# EAGLE design BusPirate-v3.5e-SSOP (EAGLE 5.11)
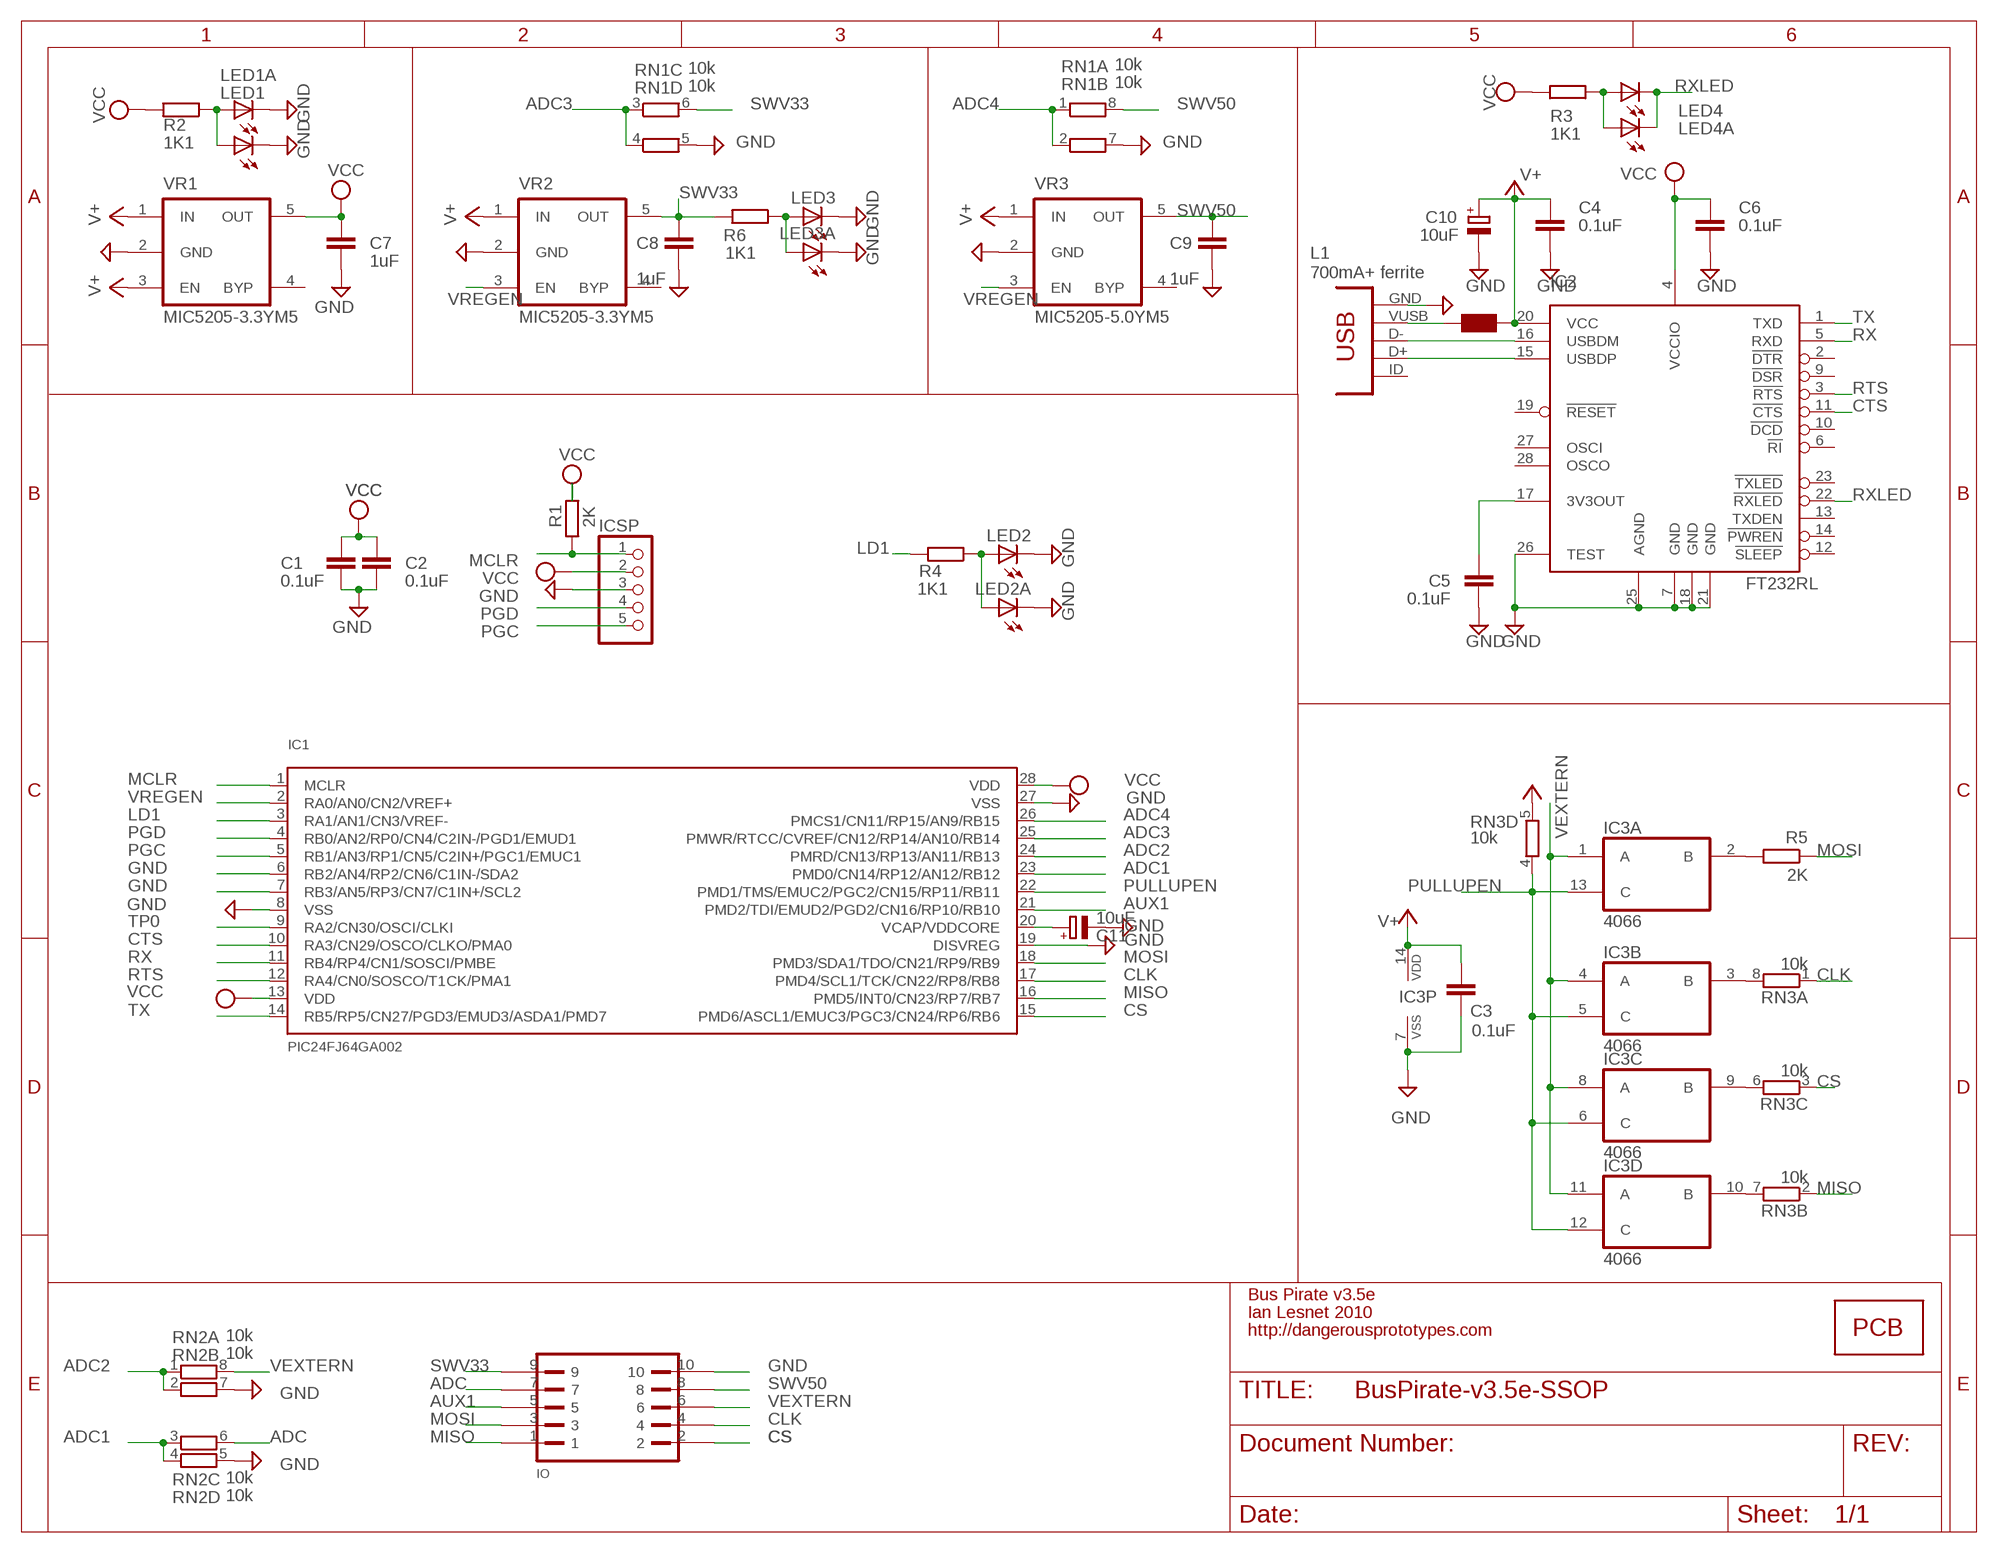
[diagram p0: schematic, sheet 1]

## Parts
C1  0.1uF  CAPC603  [C603]
C2  0.1uF  CAPC603  [C603]
C3  0.1uF  CAPC603  [C603]
C4  0.1uF  CAPC603  [C603]
C5  0.1uF  CAPC603  [C603]
C6  0.1uF  CAPC603  [C603]
C7  1uF  CAPC603  [C603]
C8  1uF  CAPC603  [C603]
C9  1uF  CAPC603  [C603]
C10  10uF  CPOL-EUSMCA  [SMC_A]
C11  10uF  CPOL-EUSMCA  [SMC_A]
IC1  PIC24FJ64GA002  [SSOP28]
IC2  FT232RL  [SSOP28]
IC3  4066  [TSSOP14]
ICSP  PINHD-1X5  [1X05]
IO  HEADER2X5-SHRD-PTH-B  [PINSHRD_PTH_2X05B]
J1  CON-USB-MINI-BUSB1  [CONN_USB_MINI-B]
L1  700mA+ ferrite  WE-KIL_0805  [WE-KI_0805_B]
LED1  LEDCHIP-LED0805  [CHIP-LED0805]
LED1A  LEDCHIP-LED0805  [CHIP-LED0805]
LED2  LEDCHIP-LED0805  [CHIP-LED0805]
LED2A  LEDCHIP-LED0805  [CHIP-LED0805]
LED3  LEDCHIP-LED0805  [CHIP-LED0805]
LED3A  LEDCHIP-LED0805  [CHIP-LED0805]
LED4  LEDCHIP-LED0805  [CHIP-LED0805]
LED4A  LEDCHIP-LED0805  [CHIP-LED0805]
R1  2K  RESISTORR603  [R603]
R2  1K1  RESISTORR603  [R603]
R3  1K1  RESISTORR603  [R603]
R4  1K1  RESISTORR603  [R603]
R5  2K  RESISTORR603  [R603]
R6  1K1  RESISTORR603  [R603]
RN1  10k  RNETWORK  [RN8P-4R-CRA06S]
RN2  10k  RNETWORK  [RN8P-4R-CRA06S]
RN3  10k  RNETWORK  [RN8P-4R-CRA06S]
U$2  PCB_STANDARD3.7X6  [PCB3.7X6]
VR1  MIC5205-3.3YM5  MIC5205  [SOT-23-5]
VR2  MIC5205-3.3YM5  MIC5205  [SOT-23-5]
VR3  MIC5205-5.0YM5  MIC5205  [SOT-23-5]

## Nets
$N26: J1.VUSB L1.2
ADC: IO.7 RN2.6
ADC1: IC1.23(PMD0/CN14/RP12/AN12/RB12) RN2.3 RN2.4
ADC2: IC1.24(PMRD/CN13/RP13/AN11/RB13) RN2.1 RN2.2
ADC3: IC1.25(PMWR/RTCC/CVREF/CN12/RP14/AN10/RB14) RN1.3 RN1.4
ADC4: IC1.26(PMCS1/CN11/RP15/AN9/RB15) RN1.1 RN1.2
AUX1: IC1.21(PMD2/TDI/EMUD2/PGD2/CN16/RP10/RB10) IO.5
CLK: IC1.17(PMD4/SCL1/TCK/CN22/RP8/RB8) IO.4 RN3.1
CS: IC1.15(PMD6/ASCL1/EMUC3/PGC3/CN24/RP6/RB6) IO.2 RN3.3
CTS: IC1.10(RA3/CN29/OSCO/CLKO/PMA0) IC2.11(!CTS)
GND: C1.2 C2.2 C3.2 C4.2 C5.2 C6.2 C7.2 C8.2 C9.2 C10.- C11.- IC1.6(RB2/AN4/RP2/CN6/C1IN-/SDA2) IC1.7(RB3/AN5/RP3/CN7/C1IN+/SCL2) IC1.8(VSS) IC1.19(DISVREG) IC1.27(VSS) IC2.7(GND) IC2.18(GND) IC2.21(GND) IC2.25(AGND) IC2.26(TEST) IC3.7(P:VSS) ICSP.3 IO.10 J1.GND LED1.C LED1A.C LED2.C LED2A.C LED3.C LED3A.C RN1.5 RN1.7 RN2.5 RN2.7 VR1.2(GND) VR2.2(GND) VR3.2(GND)
LD1: IC1.3(RA1/AN1/CN3/VREF-) R4.2
MCLR: IC1.1(MCLR) ICSP.1 R1.1
MISO: IC1.16(PMD5/INT0/CN23/RP7/RB7) IO.1 RN3.2
MOSI: IC1.18(PMD3/SDA1/TDO/CN21/RP9/RB9) IO.3 R5.1
N$1: IC3.2(A:B) R5.2
N$2: IC3.9(C:B) RN3.6
N$3: C11.+ IC1.20(VCAP/VDDCORE)
N$4: IC3.10(D:B) RN3.7
N$5: IC3.3(B:B) RN3.8
N$6: LED2.A LED2A.A R4.1
N$7: LED1.A LED1A.A R2.1
N$9: C5.1 IC2.17(3V3OUT)
N$13: LED4.A LED4A.A R3.1
N$15: IC2.15(USBDP) J1.D+
N$16: IC2.16(USBDM) J1.D-
N$18: LED3.A LED3A.A R6.1
PGC: IC1.5(RB1/AN3/RP1/CN5/C2IN+/PGC1/EMUC1) ICSP.5
PGD: IC1.4(RB0/AN2/RP0/CN4/C2IN-/PGD1/EMUD1) ICSP.4
PULLUPEN: IC1.22(PMD1/TMS/EMUC2/PGC2/CN15/RP11/RB11) IC3.5(B:C) IC3.6(C:C) IC3.12(D:C) IC3.13(A:C) RN3.4
RTS: IC1.12(RA4/CN0/SOSCO/T1CK/PMA1) IC2.3(!RTS)
RX: IC1.11(RB4/RP4/CN1/SOSCI/PMBE) IC2.5(RXD)
RXLED: IC2.22(!RXLED) LED4.C LED4A.C
SWV33: C8.1 IO.9 R6.2 RN1.6 VR2.5(OUT)
SWV50: C9.1 IO.8 RN1.8 VR3.5(OUT)
TP0: IC1.9(RA2/CN30/OSCI/CLKI)
TX: IC1.14(RB5/RP5/CN27/PGD3/EMUD3/ASDA1/PMD7) IC2.1(TXD)
V+: C3.1 C4.1 C10.+ IC2.20(VCC) IC3.14(P:VDD) L1.1 RN3.5 VR1.1(IN) VR1.3(EN) VR2.1(IN) VR3.1(IN)
VCC: C1.1 C2.1 C6.1 C7.1 IC1.13(VDD) IC1.28(VDD) IC2.4(VCCIO) ICSP.2 R1.2 R2.2 R3.2 VR1.5(OUT)
VEXTERN: IC3.1(A:A) IC3.4(B:A) IC3.8(C:A) IC3.11(D:A) IO.6 RN2.8
VREGEN: IC1.2(RA0/AN0/CN2/VREF+) VR2.3(EN) VR3.3(EN)
Unconnected: IC2.2(!DTR) IC2.6(!RI) IC2.9(!DSR) IC2.10(!DCD) IC2.12(!SLEEP) IC2.13(TXDEN) IC2.14(!PWREN) IC2.19(!RESET) IC2.23(!TXLED) IC2.27(OSCI) IC2.28(OSCO) J1.BODY@1(BODY) J1.BODY@2(BODY) J1.BODY@3(BODY) J1.BODY@4(BODY) J1.ID(USBID) VR1.4(BYP) VR2.4(BYP) VR3.4(BYP)

## Notes on the sheet
- Bus Pirate v3.5e
- Ian Lesnet 2010
- http://dangerousprototypes.com

## Library data of the parts
C1-C9 = dp_devices:CAP
C10 C11 = rcl:CPOL-EU: POLARIZED CAPACITOR, European symbol
IC1 = dp_devices:PIC24FJ64GA002: 16-bit General Purpose Flash Microcontroller
IC2 = dp_devices:FT232RL: USB to serial UART interface
IC3 = 40xx:4066: Quad bilateral ANALOG SWITCH
ICSP = pinhead:PINHD-1X5: PIN HEADER
IO = dp_devices:HEADER2X5-SHRD-PTH: Shrouded pin header, 2.54mm pitch
J1 = dp_devices:CON-USB-MINI-B: USB connector
L1 = wuerth-elektronik:WE-KIL: SMD Wire Wound Ceramic Inductor WE-KIL - Low profile - High Q values -- Bluetooth -- Wireless LAN -- RF oscillation circuit -- IF impedance matching
LED1 LED1A LED2 LED2A LED3 LED3A LED4 LED4A = led:LED: LED OSRAM: - CHIPLED LG R971, LG N971, LY N971, LG Q971, LY Q971, LO R971, LY R971 LH N974, LH R974 LS Q976, LO Q976, LY Q976 LO Q996 - Hyper CHIPLED LW Q18S LB Q993, LB Q99A, LB R99A - SideLED LS A670, LO A670, LY A670, LG A670, LP A670 LB A673, LV A673, LT A673, LW A673 LH A674 LY A675 LS A676, LA A676, LO A676, LY A676, LW A676 LS A679, LY A679, LG A679 - Hyper Micro SIDELED® LS Y876, LA Y876, LO Y876, LY Y876 LT Y87S - SmartLED LW L88C, LW L88S LB L89C, LB L89S, LG L890 LS L89K, LO L89K, LY L89K LS L896, LA L896, LO L896, LY L896 - TOPLED LS T670, LO T670, LY T670, LG T670, LP T670 LSG T670, LSP T670, LSY T670, LOP T670, LYG T670 LG T671, LOG T671, LSG T671 LB T673, LV T673, LT T673, LW T673 LH T674 LS T676, LA T676, LO T676, LY T676, LB T676, LH T676, LSB T676, LW T676 LB T67C, LV T67C, LT T67C, LS T67K, LO T67K, LY T67K, LW E67C LS E67B, LA E67B, LO E67B, LY E67B, LB E67C, LV E67C, LT E67C LW T67C LS T679, LY T679, LG T679 LS T770, LO T770, LY T770, LG T770, LP T770 LB T773, LV T773, LT T773, LW T773 LH T774 LS E675, LA E675, LY E675, LS T675 LS T776, LA T776, LO T776, LY T776, LB T776 LHGB T686 LT T68C, LB T68C - Hyper Mini TOPLED® LB M676 - Mini TOPLED Santana® LG M470 LS M47K, LO M47K, LY M47K Source: http://www.osram.convergy.de LUXEON: - LUMILED® LXK2-PW12-R00, LXK2-PW12-S00, LXK2-PW14-U00, LXK2-PW14-V00 LXK2-PM12-R00, LXK2-PM12-S00, LXK2-PM14-U00 LXK2-PE12-Q00, LXK2-PE12-R00, LXK2-PE12-S00, LXK2-PE14-T00, LXK2-PE14-U00 LXK2-PB12-K00, LXK2-PB12-L00, LXK2-PB12-M00, LXK2-PB14-N00, LXK2-PB14-P00, LXK2-PB14-Q00 LXK2-PR12-L00, LXK2-PR12-M00, LXK2-PR14-Q00, LXK2-PR14-R00 LXK2-PD12-Q00, LXK2-PD12-R00, LXK2-PD12-S00 LXK2-PH12-R00, LXK2-PH12-S00 LXK2-PL12-P00, LXK2-PL12-Q00, LXK2-PL12-R00 Source: www.luxeon.com KINGBRIGHT: KA-3528ASYC Source: www.kingbright.com
R1-R6 = dp_devices:RESISTOR
RN1-RN3 = dp_devices:RNETWORK: 4 Resistor Array 0603
U$2 = dp_devices:PCB_STANDARD
VR1-VR3 = dp_devices:MIC5205: 150ma Low-Noise LDO Regulator

## Board
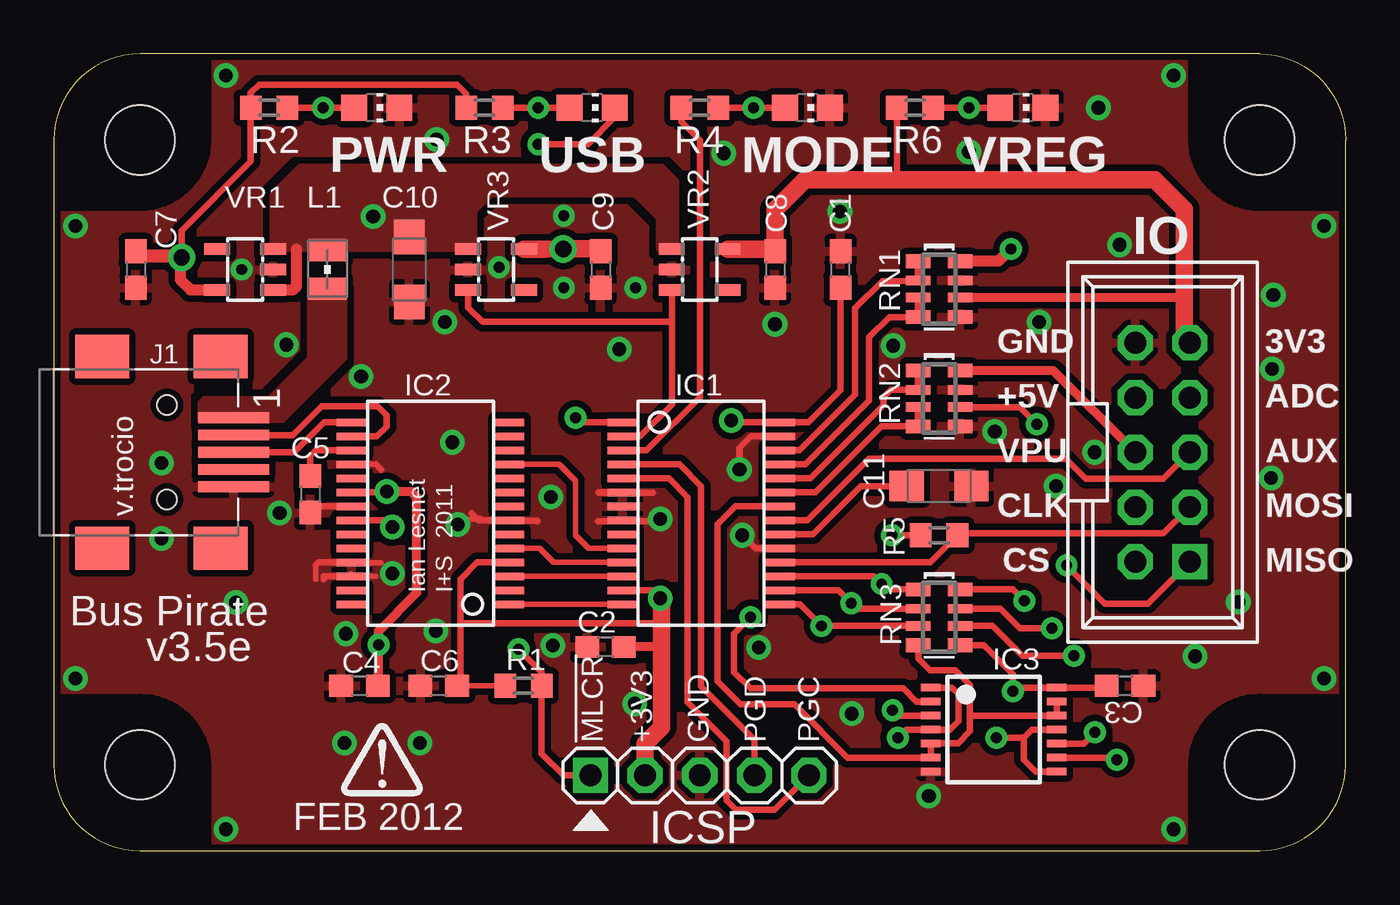
[diagram p1: board, top side]
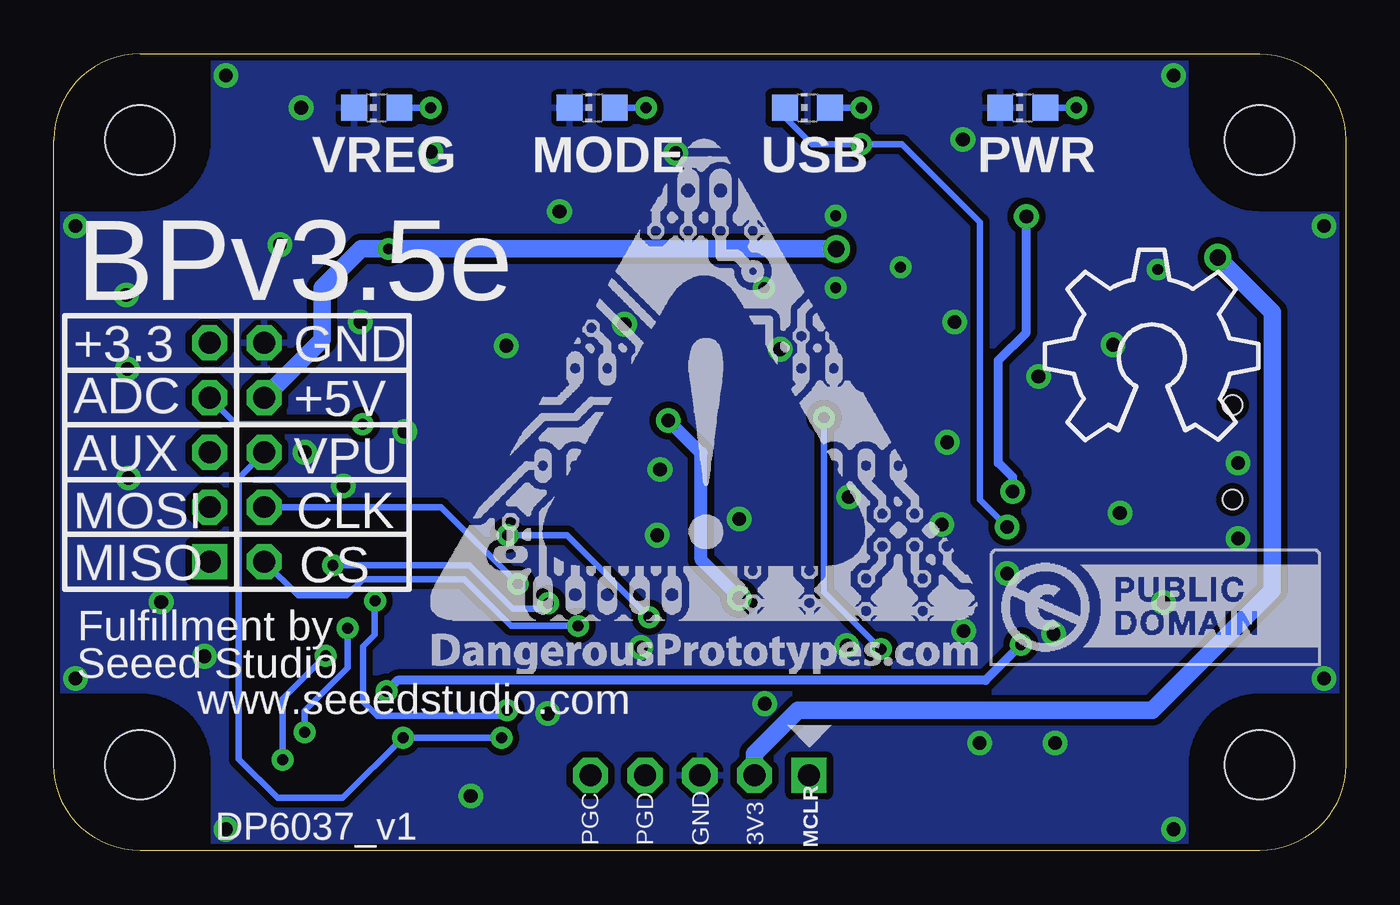
[diagram p2: board, bottom side, seen from below]

Size 60 x 37 mm. Coordinates in mm from the lower left corner, seen from the top.
Copper layers (1*16): Top 0.035mm / dielectric 1.5mm / Bottom 0.035mm
Design rules "SparkFun": minimum track width 8mil, minimum drill 20mil, track to track 8mil, track to pad 8mil, pad to pad 8mil, via to via 8mil, smd to smd 8mil, copper to edge 10mil, drill to drill 8mil, minimum pad ring 12mil, minimum via ring 10mil, stop-mask expansion 4mil, vias tented up to drill 25mil, thermal gap 10mil

### Footprints (pad centres in the part's own frame; a part is rotated, then mirrored left to right if it is on the bottom)
C603 = smd 1.1 x 1: 1 -0.85,0; 2 0.85,0
SMC_A = smd 1.6 x 1.4: + -1.5,0; - 1.5,0
SSOP28 = smd 0.348 x 1.397: 1 -4.225,-3.656; 2 -3.575,-3.656; 3 -2.925,-3.656; 4 -2.275,-3.656; 5 -1.625,-3.656; 6 -0.975,-3.656; 7 -0.325,-3.656; 8 0.325,-3.656; 9 0.975,-3.656; 10 1.625,-3.656; 11 2.275,-3.656; 12 2.925,-3.656; 13 3.575,-3.656; 14 4.225,-3.656; 15 4.225,3.656; 16 3.575,3.656; 17 2.925,3.656; 18 2.275,3.656; 19 1.625,3.656; 20 0.975,3.656; 21 0.325,3.656; 22 -0.325,3.656; 23 -0.975,3.656; 24 -1.625,3.656; 25 -2.275,3.656; 26 -2.925,3.656; 27 -3.575,3.656; 28 -4.225,3.656
TSSOP14 = smd 0.35 x 0.9: 1 -1.95,-2.925; 2 -1.3,-2.925; 3 -0.65,-2.925; 4 0,-2.925; 5 0.65,-2.925; 6 1.3,-2.925; 7 1.95,-2.925; 8 1.95,2.925; 9 1.3,2.925; 10 0.65,2.925; 11 0,2.925; 12 -0.65,2.925; 13 -1.3,2.925; 14 -1.95,2.925
1X05 = drill 1.016 square: 1 -5.08,0 | drill 1.016 octagon: 2 -2.54,0; 3 0,0; 4 2.54,0; 5 5.08,0
PINSHRD_PTH_2X05B = drill 1.016 square: 1 -5.08,-1.27 | drill 1.016 octagon: 2 -5.08,1.27; 3 -2.54,-1.27; 4 -2.54,1.27; 5 0,-1.27; 6 0,1.27; 7 2.54,-1.27; 8 2.54,1.27; 9 5.08,-1.27; 10 5.08,1.27
CONN_USB_MINI-B = smd 2 x 2.5: BODY@1 -4.45,2.5; BODY@2 4.45,2.5; BODY@3 4.45,-3; BODY@4 -4.45,-3 | smd 0.5 x 3.3: D+ 0,3.1; D- -0.8,3.1; GND 1.6,3.1; ID 0.8,3.1; VUSB -1.6,3.1 | hole 0.9: -2.2,0; 2.2,0
WE-KI_0805_B = smd 1.02 x 1.78: 1 -0.89,0; 2 0.89,0
CHIP-LED0805 = smd 1.2 x 1.2: A 0,-1.05; C 0,1.05
DP6037_V1 = hole 3.2: 4,4; 56,4; 56,33; 4,33
R603 = smd 1 x 1.1: 1 -0.85,0; 2 0.85,0
RN8P-4R-CRA06S = smd 0.63 x 1.15: 1 -1.295,-0.975; 4 1.295,-0.975; 5 1.295,0.975; 8 -1.295,0.975 | smd 0.44 x 1.15: 2 -0.4,-0.975; 3 0.4,-0.975; 6 0.4,0.975; 7 -0.4,0.975
SOT-23-5 = smd 0.55 x 1.2: 1 -0.95,-1.3; 2 0,-1.3; 3 0.95,-1.3; 4 0.95,1.3; 5 -0.95,1.3

### Placement (x,y rotation side)
C1  36.55,26.99 90 top
C2  25.62,9.46 180 top
C3  49.75,7.66 0 top
C4  14.19,7.66 180 top
C5  11.91,16.55 270 top
C6  17.88,7.66 180 top
C7  3.81,26.99 270 top
C8  33.5,26.99 270 top
C9  25.4,26.99 270 top
C10  16.51,26.99 270 top
C11  41.12,16.93 0 top
IC1  30.07,15.66 270 top
IC2  17.5,15.66 90 top
IC3  43.66,5.63 270 top
ICSP  30,3.5 0 top
IO  51.5,18.5 90 top
J1  5.25,18.5 270 top
L1  12.7,26.99 270 top
LED1  15,34.5 270 top
LED1A  15,34.5 90 bottom
LED2  35,34.5 270 top
LED2A  35,34.5 90 bottom
LED3  45,34.5 270 top
LED3A  45,34.5 90 bottom
LED4  25,34.5 270 top
LED4A  25,34.5 90 bottom
LOGO1  LOGO_CC-0  [LOGO_CC-0]  16.5,8.62 0 bottom
PCB1  PCB_DP_RECTANGLE-37X60  [DP6037_V1]  0,0 0 top
R1  21.81,7.66 180 top
R2  10,34.5 180 top
R3  20,34.5 180 top
R4  30,34.5 180 top
R5  41.12,14.65 180 top
R6  40,34.5 180 top
RN1  41.12,26.08 270 top
RN2  41.12,21 270 top
RN3  41.12,10.84 270 top
U$1  [DP-LOGO]  13.34,2.54 0 top
U$2  [OSHW_8X350_NOTEXT]  13.97,19.05 0 bottom
U$3  [DP_LOGO_ART_1X1]  42.49,8.24 0 bottom
VR1  8.89,26.99 90 top
VR2  30,26.99 270 top
VR3  20.54,26.99 270 top

### Tracks (layer width: path | path; a pad name or v marks a point on that pad's centre or on a via)
$N26
  Top 0.305: 7.39,20.1 J1.VUSB
  pour Top (isolate 0.305, no thermals): 6.83,20 6.83,20.8 6.99,20.95 10,20.95 11.91,22.86 11.91,25.88 12.06,26.04 13.34,26.04 13.49,25.88 13.49,22.86 10.64,20
ADC  (via drill 0.51)
  Top 0.305: RN2.6 44.87,20.6 v45.66,19.8
  Bottom 0.305: v45.66,19.8 45.85,19.81 51.53,19.81 IO.7
ADC1
  Top 0.305: RN2.3 RN2.4 38.45,19.7 35.38,16.64 IC1.23
ADC2
  Top 0.305: RN2.1 RN2.2 38.87,21.4 38.54,21.06 38.54,20.68 35.14,17.29 IC1.24
ADC3
  Top 0.305: RN1.3 RN1.4 38.8,24.78 37.85,23.83 37.85,20.89 34.91,17.94 IC1.25
ADC4
  Top 0.305: RN1.1 RN1.2 39.22,26.45 38.49,26.45 37.22,25.18 37.22,21.16 34.64,18.59 IC1.26
AUX1
  Top 0.305: IC1.21 35,15.34 37.86,18.2 47.01,18.2 47.94,17.27 51.53,17.27 IO.5
CLK  (via drill 0.51)
  Top 0.305: IC1.17 38.1,12.74 v38.45,12.39 38.7,12.13 RN3.1
  Bottom 0.305: v38.45,12.39 42.02,15.96 IO.4
CS  (via drill 0.51)
  Top 0.305: v35.66,10.44 RN3.3 | v35.66,10.44 35.8,10.44 | v35.66,10.44 34.66,11.44 IC1.15
  Bottom 0.305: v35.66,10.44 38.76,10.44 40.94,12.62 45.64,12.62 46.4,11.85 48.65,11.85 IO.2
CTS
  Top 0.254: IC2.11 23.48,17.94 24.23,17.19 24.23,14.65 24.84,14.04 IC1.10
GND  (via drill 0.51, 0.64)
  Top 0.254: 14.97,17.94 IC2.18 | 12.16,12.62 12.16,13.25 | 13.69,13.38 15.21,13.38 | 13.81,12.74 13.81,12.87 | 13.81,12.74 14.96,12.74 | IC2.26 13.82,12.74 13.81,12.74
  Top 0.305: 19.73,15.34 19.8,15.41 19.65,15.41 | 19.65,15.41 19.4,15.41 | 19.73,15.34 IC2.7 | 19.65,15.41 19.4,15.66 | 19.65,15.41 19.73,15.34 | 15.21,17.7 14.97,17.94 | IC2.21 12.03,15.99 C5.2 | IC2.25 12.3,13.39 12.16,13.25 | IC2.26 12.54,12.74 12.54,12.62 | v31.85,17.7 31.85,18.71 32.37,19.24 IC1.27 33.6,19.24 | IC1.19 32.58,14.04 v31.97,14.65 | 27.83,16.63 25.29,16.63 25.3,16.64 IC1.6 | 25.27,15.31 28.06,15.31 | 20.92,15.33 22.45,15.33 22.47,15.31
  other vias: 20.67,27.09 8.73,26.99 8,1 13.5,5 17,5 1,8 52,1 59,8 55.01,11.55 56.53,17.31 56.59,22.36 56.64,25.8 59,29 49.5,28.13 36.51,29.69 42.5,32.45 52,36 31.11,32.38 17.78,33.02 18.51,18.96 18.77,15.15 17.75,10.2 13.56,10.07 8.45,11.52 10.48,15.69 10.79,23.5 14.27,22.01 32.73,9.44 15.72,12.87 53,9.03 40.64,2.54 46.55,16.93 48.33,18.5 43.7,19.47 23.08,16.43 28.16,15.41 37.06,6.37 38.98,23.45 33.5,24.45 26.26,23.28 1,29 8,36 48.51,34.5 45.77,24.55 26.99,6.83 18.16,24.55 23.69,26.14 27.02,26.14 23.69,29.47 23.18,9.53 5,14.5 5,18
  pour Top (isolate 0.305, rank 6): -0.32,36.88 59.6,36.91 59.7,-0.37 -0.35,-0.32
  pour Bottom (isolate 0.305): -0.37,36.91 59.62,36.96 59.67,-0.27 -0.37,-0.37
LD1
  Top 0.305: IC1.3 27.53,18.59 30,21.06 30,33 29.15,33.85 R4.2
MCLR  (via drill 0.51)
  Top 0.305: IC1.1 24.45,19.89 v24.23,20.11 | ICSP.1 23.67,3.5 22.66,4.51 R1.1 22.66,8.29 v21.59,9.37
  Bottom 0.305: v24.23,20.11 24.23,12 v21.59,9.37
MISO  (via drill 0.51)
  Top 0.305: v47.04,13.25 48.82,11.47 50.81,11.47 IO.1 | IC1.16 36.44,12.09 v37.03,11.49 | v37.03,11.49 36.93,11.6 | v37.03,11.49 37.29,11.24 RN3.2
  Bottom 0.305: v47.04,13.25 40.68,13.25 38.67,11.24 37.29,11.24 v37.03,11.49
MOSI
  Top 0.305: IO.3 51.53,14.73 42.1,14.73 41.98,14.65 R5.1 40.71,13.39 IC1.18
N$1  (via drill 0.51)
  Top 0.305: v38.93,14.65 R5.2 | IC3.2 40.07,6.93 39.47,7.54 32.35,7.54 31.59,8.3 31.59,10.07 v32.35,10.84
  Bottom 0.305: v38.93,14.65 36.16,14.65 v32.35,10.84
N$2  (via drill 0.51)
  Top 0.305: IC3.9 49.27,4.33 v49.37,4.23 | RN3.6 43.6,10.44 44.98,9.06 v47.37,9.06
  Bottom 0.305: v47.37,9.06 49.37,7.06 v49.37,4.23
N$3
  Top 0.305: IC1.20 35.26,14.69 37.5,16.92 39.61,16.92 C11.+
N$4  (via drill 0.51)
  Top 0.305: IC3.10 47.83,4.98 v48.36,5.5 | v46.36,10.33 44.88,10.33 43.97,11.24 RN3.7
  Bottom 0.305: v46.36,10.33 46.36,8.49 48.36,6.5 v48.36,5.5
N$5  (via drill 0.51)
  Top 0.305: IC3.3 39.2,6.28 v38.96,6.52 | RN3.8 44.55,12.13 v45.09,11.6
  Bottom 0.305: v38.96,6.52 39.21,6.26 44.98,6.26 45.62,6.92 45.62,9.51 45.09,10.04 v45.09,11.59 v45.09,11.6
N$6  (via drill 0.51)
  Top 0.305: R4.1 v32.5,34.5 LED2A.A
  Bottom 0.305: v32.5,34.5 LED2A.A
N$7  (via drill 0.51)
  Top 0.305: R2.1 v12.5,34.5 LED1A.A
  Bottom 0.305: v12.5,34.5 LED1A.A
N$9
  Top 0.305: IC2.17 12.16,18.59 11.91,18.33 C5.1
N$13  (via drill 0.51)
  Top 0.305: R3.1 v22.5,34.5 LED4A.A
  Bottom 0.305: v22.5,34.5 LED4A.A
N$15
  Top 0.305: IC2.15 12.55,19.89 11.93,19.26 11.92,19.26 11.16,18.5 J1.D+
N$16
  Top 0.254: IC2.16 13.86,19.22
  Top 0.305: IC2.16 15,19.24 15.45,19.69 15.45,20.23 15.04,20.63 12.43,20.63 11.1,19.3 J1.D-
N$18  (via drill 0.51)
  Top 0.305: R6.1 v42.5,34.5 LED3A.A
  Bottom 0.305: v42.5,34.5 LED3A.A
PGC
  Top 0.305: IC1.5 28.57,17.29 29.43,16.43 29.43,6.88 31.24,5.08 31.24,2.35 31.69,1.9 33.48,1.9 ICSP.5
PGD
  Top 0.305: IC1.4 29.06,17.94 30.07,16.93 30.07,7.63 32.54,5.16 ICSP.4
PULLUPEN
  Top 0.305: 42.55,6.26 42.55,5.54 42.01,5 40.75,5 IC3.5 IC3.6 36.87,4.33 34.4,6.8 31.9,6.8 30.83,7.87 30.83,15.15 31.66,15.99 IC1.22 | 42.55,6.26 42.57,6.28 IC3.12 IC3.13 | 42.55,6.26 42.55,7.7 41.87,8.39 40.7,8.39 40.17,8.92 RN3.4
RTS
  Top 0.254: IC2.3 IC1.12
RX
  Top 0.254: IC2.5 22.55,14.04 23.2,13.39 IC1.11
RXLED  (via drill 0.51, 0.64)
  Top 0.305: IC2.22 15.39,15.34 v15.72,15.03 | v22.5,32.8 24.8,32.8 26.05,34.05 LED4A.C
  Bottom 0.305: v15.72,15.03 16.99,16.3 16.99,29.19 20.6,32.8 v22.5,32.8 24.8,32.8 26.05,34.05 LED4A.C
SWV33
  Top 0.305: 44.55,31.22 44.48,31.22 44.55,31.16 | R6.2 39.15,31.41 38.9,31.16
  Top 0.406: RN1.6 52.35,25.68 52.5,25.82
  Top 0.508: 33.4,27.94 C8.1
  Top 0.813: C8.1 33.5,29.76 34.89,31.16 38.9,31.16 44.55,31.16 51.14,31.16 52.5,29.79 52.5,25.82 52.5,23.83 IO.9 | VR2.5 33.4,27.94
SWV50  (via drill 0.51, 0.76)
  Top 0.508: RN1.8 43.88,27.37 v44.45,27.94 | 25.33,27.98 25.36,27.98 25.4,27.94
  Top 0.61: 25.33,27.98 C9.1
  Top 0.813: VR3.5 22.77,27.94 v23.65,27.94 25.4,27.94
  Bottom 0.813: v23.65,27.94 v44.45,27.94 45.72,27.94 47.53,26.13 47.53,23.72 IO.8
TX
  Top 0.254: IC2.1 IC1.14
V+  (via drill 0.51, 0.64)
  Top 0.305: IC2.20 15.42,16.64 v15.46,16.68 | C3.1 48.82,7.58 IC3.14 44.63,7.58 v44.55,7.41 | 42.13,9.53 43.19,9.53 44.53,8.19 44.53,7.42
  Top 0.406: v15.08,9.57 15.08,8.36 C4.1 15.08,7.7 v15.08,9.57 | v15.08,9.57 15.08,10.2 16.86,11.98 16.86,16.43 16.61,16.68 v15.46,16.68 | 42.13,9.53 RN3.5 | v44.55,7.41 44.53,7.42
  Top 0.508: VR1.1 11.12,26.04 11.27,26.19 11.27,27.94
  Bottom 0.406: v15.08,9.57 16.73,7.92 44.04,7.92 v44.55,7.41 | v15.46,16.68 15.46,17.34 16.14,18.02 16.14,22.77 14.84,24.06 14.84,27.84 v14.83,29.44
  pour Top (isolate 0.305, no thermals): 10.16,30.48 10.16,27.94 19.53,27.94 19.53,29.69 20.32,30.48 26.99,30.48 28.1,29.37 28.1,27.94 28.89,27.94 28.89,31.11 28.26,31.75 11.43,31.75
VCC  (via drill 0.64, 0.76)
  Top 0.254: C6.1 R1.2
  Top 0.305: 28.31,12.09 v28.16,11.73 27.8,12.09 IC1.13 | v31.46,19.98 31.56,19.89 IC1.28 35.05,19.89 36.55,21.38 C1.1 | 28.23,10.57 18.89,10.57 | 18.89,10.57 18.89,7.83 C6.1 | IC2.4 19.66,13.39 18.89,12.62 18.89,10.57 | v5.95,27.55 v5.94,27.54 5.94,28.8 9.15,32.01 R2.2 9.15,35.19 9.53,35.56 18.73,35.56 19.15,35.14 R3.2
  Top 0.406: C2.1 28.1,9.46 28.23,9.34
  Top 0.508: 6,27.6 v5.94,27.54 5.87,27.47 5.87,26.51 6.35,26.04 VR1.5
  Top 0.61: 28.23,11.66 v28.16,11.73 | v5.94,27.54 5.94,27.6 | 5.87,27.6 3.78,27.6 C7.1
  Top 0.813: v5.94,27.54 5.87,27.6 | 28.23,11.66 28.23,10.57 28.23,9.34 28.23,5.73 27.46,4.96 ICSP.2
  Bottom 0.61: v28.16,11.73 29.94,13.5 29.94,18.46 v31.46,19.98
  Bottom 0.813: v5.94,27.54 3.41,25.01 3.41,12.1 8.99,6.52 25.44,6.52 27.46,4.5 ICSP.2
VEXTERN  (via drill 0.51)
  Top 0.305: IC3.8 45.61,3.68 45.05,4.23 45.05,5.25 | IC3.11 45.44,5.63 45.05,5.25 | IC3.1 41.71,7.58 42.01,7.28 42.01,6.01 41.62,5.63 IC3.4 39.59,5.63 v39.21,5.25 | v43.78,5.25 45.05,5.25
  Top 0.406: RN2.8 46.42,22.29 IO.6
  Bottom 0.305: v39.21,5.25 v43.78,5.25 46.58,2.46 49.61,2.46 51.42,4.26 51.42,17.3 IO.6
VREGEN
  Top 0.305: 19.24,25.22 19.91,24.55 28.7,24.55 | IC1.2 27.23,19.24 28.7,20.71 28.7,24.13 28.7,24.55 | 19.24,25.22 VR3.3 | 19.24,25.22 | 28.7,24.55 VR2.3

### Text on the board
tPlace: GND | 3V3 | +5V | ADC | VPU | AUX | CLK | MOSI | CS | MISO | !MLCR | +3V3 | GND | PGD | PGC
tNames: PWR | USB | MODE | VREG | v.trocio | 2011 | Ian Lesnet | I+S | Bus Pirate | v3.5e | FEB 2012
bNames: PWR | USB | MODE | VREG | BPv3.5e | GND | +3.3 | +5V | ADC | VPU | AUX | CLK | MOSI | MISO | CS | Fulfillment by | Seeed Studio | www.seeedstudio.com | MCLR | 3V3 | GND | PGD | PGC
Reference: GND | +3v | +5v | ADC | USB | Vpu | AUX | CLK | MOSI | CS | MISO | I/O header | MCLR | +3.3V | GND | DATA | CLOCK | Bus Pirate v3.5e | Ian Lesnet | CC-0 | FEB 2012 | Programming Header | http://dangerousprototypes.com